# Altium project Laser_Module.PrjPCB (part 2 of 3)

## Sheet LVDS_ADC.SchDoc: ADC &
size 420 x 297 mm; CheckedBy: MK; Author: G.K.; CompanyName: CREOTECH; DrawnBy: G.K.; Organization: CTI SA; Address1: Creotech Instruments SA; Address2: Okulickiego 7/9, 05-500 Poland; DocumentNumber: 2; Revision: -; SheetNumber: 2; SheetTotal: 5; ModifiedBy: -; CreateDate: XX/XX/XXXX; CheckedDate: -; Title2: reference; DivGrp: CTI; Designer: G.K.; ModifiedDate: -; ProjectName: FMC DAC 100M 14B 16CHA ADC 2M 14B 4CHA
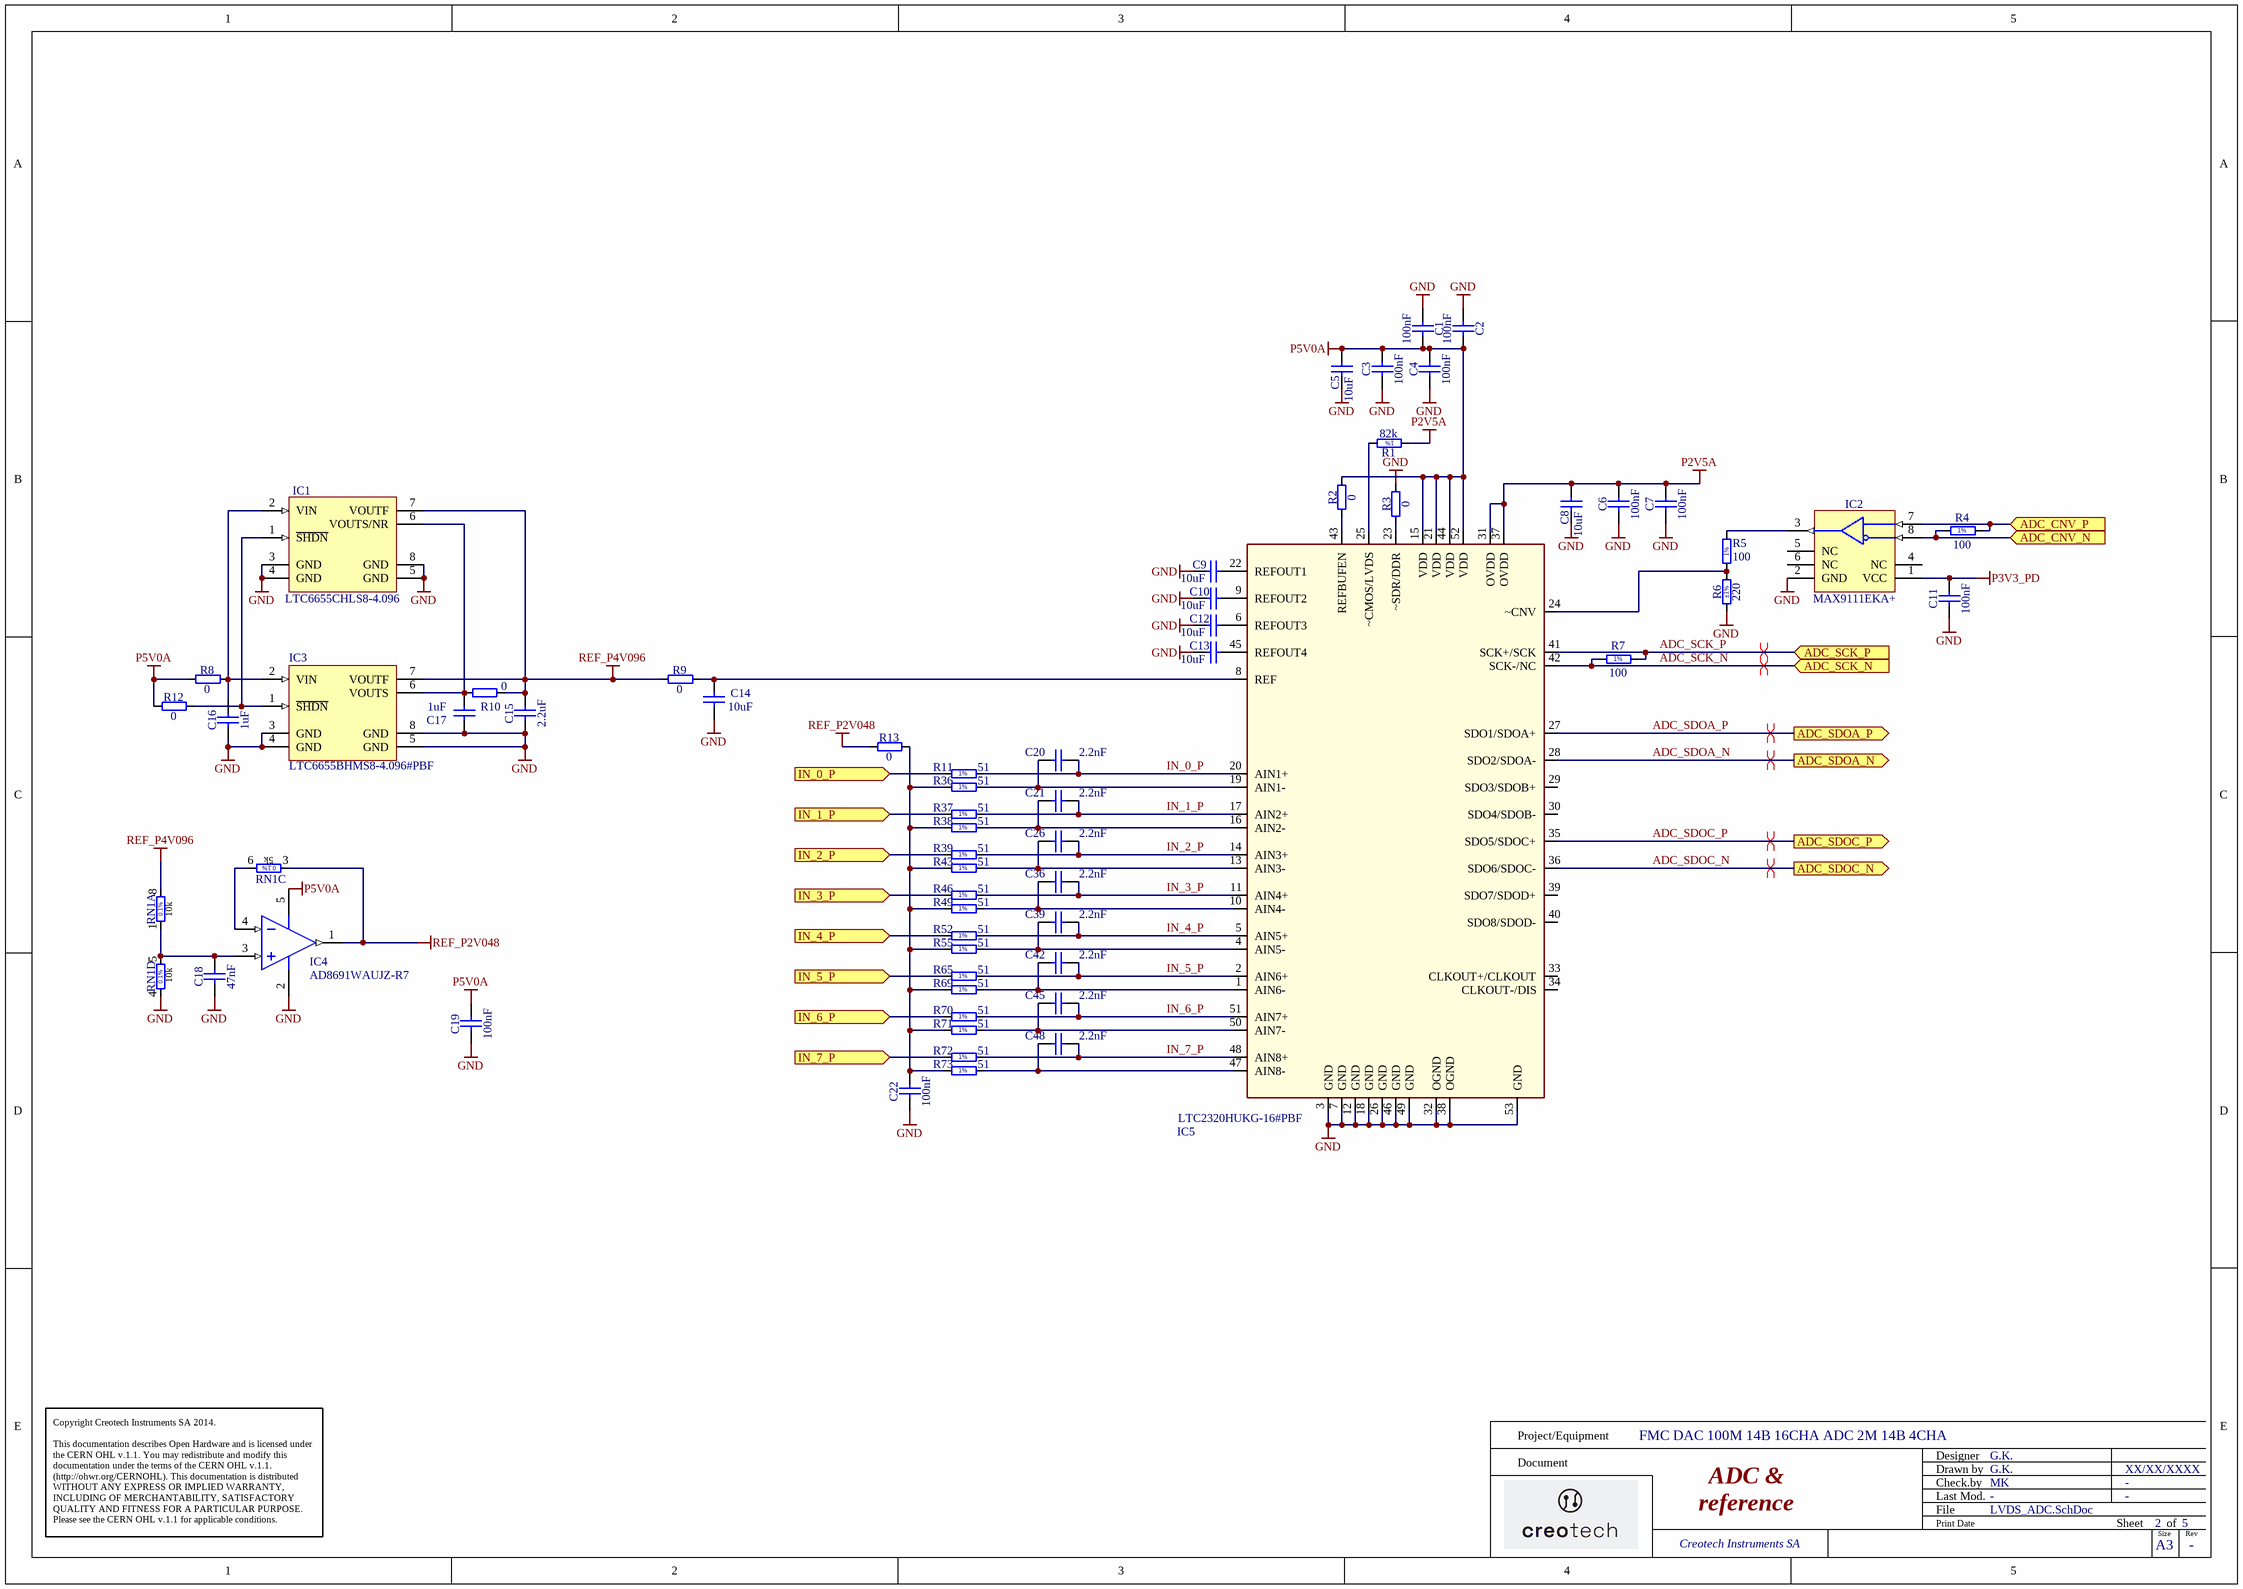
[diagram p2: LVDS_ADC.SchDoc]

### Parts
C1  100nF  [CAPC1608X87N]
C2  100nF  [CAPC1608X87N]
C3  100nF  [CAPC1608X87N]
C4  100nF  [CAPC1608X87N]
C5  10uF  [CAPC2012X95N]
C6  100nF  [CAPC1608X87N]
C7  100nF  [CAPC1608X87N]
C8  10uF  [CAPC2012X95N]
C9  10uF  [CAPC2012X95N]
C10  10uF  [CAPC2012X95N]
C11  100nF  [CAPC1608X87N]
C12  10uF  [CAPC2012X95N]
C13  10uF  [CAPC2012X95N]
C14  10uF  [CAPC2012X95N]
C15  2.2uF  [CAPC1608X87N]
C16  1uF  [CAPC1608X87N]
C17  1uF  [CAPC1608X87N]
C18  47nF  [CAPC2012X135N]
C19  100nF  [CAPC1005X55N]
C20  2.2nF  [CAPC2013X100N]
C21  2.2nF  [CAPC2013X100N]
C22  100nF  [CAPC1005X55N]
C26  2.2nF  [CAPC2013X100N]
C36  2.2nF  [CAPC2013X100N]
C39  2.2nF  [CAPC2013X100N]
C42  2.2nF  [CAPC2013X100N]
C45  2.2nF  [CAPC2013X100N]
C48  2.2nF  [CAPC2013X100N]
IC1  LTC6655CHLS8-4.096  [LCCS127P500X500X145-8N]
IC2  MAX9111EKA+  [SOT65P280X145-8N]
IC3  LTC6655BHMS8-4.096#PBF  [SOP65P490X110-8N]
IC4  AD8691WAUJZ-R7  [ADI-UJ-5_L]
IC5  LTC2320HUKG-16#PBF  [QFN50P700X800X80_HS-53M]
R1  82k  [RESC1608X55N]
R2  0  [RESC1005X40N]
R3  0  [RESC1005X40N]
R4  100  [RESC1005X40N]
R5  100  [RESC1005X40N]
R6  220  Tolerance: ±1%  [RESC1005X40N]
R7  100  [RESC1005X40N]
R8  0  [RESC1005X40N]
R9  0  [RESC1005X40N]
R10  0  [RESC1005X40N]
R11  51  [RESC1005X40N]
R12  0  [RESC1005X40N]
R13  0  [RESC1005X40N]
R36  51  [RESC1005X40N]
R37  51  [RESC1005X40N]
R38  51  [RESC1005X40N]
R39  51  [RESC1005X40N]
R43  51  [RESC1005X40N]
R46  51  [RESC1005X40N]
R49  51  [RESC1005X40N]
R52  51  [RESC1005X40N]
R55  51  [RESC1005X40N]
R65  51  [RESC1005X40N]
R69  51  [RESC1005X40N]
R70  51  [RESC1005X40N]
R71  51  [RESC1005X40N]
R72  51  [RESC1005X40N]
R73  51  [RESC1005X40N]
RN1  10k 5K 5K 10K  [SOIC127P600X175-8N]  (value not drawn)  (parts A,C,D of 4)

### Ports
ADC_CNV_N (in), ADC_CNV_P (in), ADC_SCK_N (in), ADC_SCK_P (in), ADC_SDOA_N (out), ADC_SDOA_P (out), ADC_SDOC_N (out), ADC_SDOC_P (out), IN_0_P (in), IN_1_P (in), IN_2_P (in), IN_3_P (in), IN_4_P (in), IN_5_P (in), IN_6_P (in), IN_7_P (in)

### Nets
GND: C1.1 C2.1 C3.1 C4.1 C5.1 C6.1 C7.1 C8.1 C9.1 C10.1 C11.1 C12.1 C13.1 C14.1 C15.1 C16.1 C17.1 C18.1 C19.1 C22.1 IC1.3(GND) IC1.4(GND) IC1.5(GND) IC1.8(GND) IC2.2(GND) IC3.3(GND) IC3.4(GND) IC3.5(GND) IC3.8(GND) IC4.2(-V) IC5.3(GND) IC5.7(GND) IC5.12(GND) IC5.18(GND) IC5.26(GND) IC5.32(OGND) IC5.38(OGND) IC5.46(GND) IC5.49(GND) IC5.53(GND) R3.2 R6.1 RN1.4
P2V5A: C6.2 C7.2 C8.2 IC5.31(OVDD) IC5.37(OVDD) R1.1
P3V3_PD: C11.2 IC2.1(VCC)
P5V0A: C1.2 C2.2 C3.2 C4.2 C5.2 C19.2 IC4.5(+V) IC5.15(VDD) IC5.21(VDD) IC5.44(VDD) IC5.52(VDD) R2.2 R8.1 R12.1
REF_P2V048: IC4.1(OUT) R13.1 RN1.3
REF_P4V096: C15.2 IC1.7(VOUTF) IC3.7(VOUTF) R9.1 R10.2 RN1.8
ADC_SCK_N: IC5.42(SCK-/NC) R7.1 ; port ADC_SCK_N
ADC_SCK_P: IC5.41(SCK+/SCK) R7.2 ; port ADC_SCK_P
ADC_SDOA_N: IC5.28(SDO2/SDOA-) ; port ADC_SDOA_N
ADC_SDOA_P: IC5.27(SDO1/SDOA+) ; port ADC_SDOA_P
ADC_SDOC_N: IC5.36(SDO6/SDOC-) ; port ADC_SDOC_N
ADC_SDOC_P: IC5.35(SDO5/SDOC+) ; port ADC_SDOC_P
IN_0_P: C20.1 IC5.20(AIN1+) R11.2
IN_1_P: C21.1 IC5.17(AIN2+) R37.2
IN_2_P: C26.1 IC5.14(AIN3+) R39.2
IN_3_P: C36.1 IC5.11(AIN4+) R46.2
IN_4_P: C39.1 IC5.5(AIN5+) R52.2
IN_5_P: C42.1 IC5.2(AIN6+) R65.2
IN_6_P: C45.1 IC5.51(AIN7+) R70.2
IN_7_P: C48.1 IC5.48(AIN8+) R72.2
QSPI_NCS_N: IC2.8(IN-) R4.1 ; port ADC_CNV_N
QSPI_NCS_P: IC2.7(IN+) R4.2 ; port ADC_CNV_P
NetC9_2: C9.2 IC5.22(REFOUT1)
NetC10_2: C10.2 IC5.9(REFOUT2)
NetC12_2: C12.2 IC5.6(REFOUT3)
NetC13_2: C13.2 IC5.45(REFOUT4)
NetC14_2: C14.2 IC5.8(REF) R9.2
NetC16_2: C16.2 IC1.2(VIN) IC3.2(VIN) R8.2
NetC17_2: C17.2 IC1.6(VOUTS/NR) IC3.6(VOUTS) R10.1
NetC18_2: C18.2 IC4.3(+IN) RN1.1 RN1.5
NetC20_2: C20.2 IC5.19(AIN1-) R36.2
NetC21_2: C21.2 IC5.16(AIN2-) R38.2
NetC22_2: C22.2 R13.2 R36.1 R38.1 R43.1 R49.1 R55.1 R69.1 R71.1 R73.1
NetC26_2: C26.2 IC5.13(AIN3-) R43.2
NetC36_2: C36.2 IC5.10(AIN4-) R49.2
NetC39_2: C39.2 IC5.4(AIN5-) R55.2
NetC42_2: C42.2 IC5.1(AIN6-) R69.2
NetC45_2: C45.2 IC5.50(AIN7-) R71.2
NetC48_2: C48.2 IC5.47(AIN8-) R73.2
NetC50_2: R70.1 ; port IN_6_P
NetC61_2: R11.1 ; port IN_0_P
NetC62_2: R37.1 ; port IN_1_P
NetC63_2: R39.1 ; port IN_2_P
NetC64_2: R46.1 ; port IN_3_P
NetC65_2: R52.1 ; port IN_4_P
NetC66_2: R65.1 ; port IN_5_P
NetIC1_1: IC1.1(~{SHDN}) IC3.1(~{SHDN}) R12.2
NetIC2_3: IC2.3(OUT) R5.2
NetIC4_4: IC4.4(-IN) RN1.6
NetIC5_23: IC5.23(~SDR/DDR) R3.1
NetIC5_24: IC5.24(~CNV) R5.1 R6.2
NetIC5_25: IC5.25(~CMOS/LVDS) R1.2
NetIC5_43: IC5.43(REFBUFEN) R2.1
NetR72_1: R72.1 ; port IN_7_P

Not connected (* = marked no-connect by the designer): IC2 4(NC) 5(NC) 6(NC); IC5 29(SDO3/SDOB+) 30(SDO4/SDOB-) 33(CLKOUT+/CLKOUT) 34(CLKOUT-/DIS) 39(SDO7/SDOD+) 40(SDO8/SDOD-)

### Layout directives
differential pair: ADC_SCK_N, ADC_SCK_P, ADC_SDOA_N, ADC_SDOA_P, ADC_SDOC_N, ADC_SDOC_P

### Notes on the sheet
- Project/Equipment
- Document
- Designer
- Drawn by
- Check.by
- Copyright Creotech Instruments SA 2014.
  This documentation describes Open Hardware and is licensed under the CERN OHL v.1.1. You may redistribute and modify this documentation under the terms of the CERN OHL v.1.1. (http://ohwr.org/CERNOHL). This documentation is distributed WITHOUT ANY EXPRESS OR IMPLIED WARRANTY, INCLUDING OF MERCHANTABILITY, SATISFACTORY QUALITY AND FITNESS FOR A PARTICULAR PURPOSE. Please see the CERN OHL v.1.1 for applicable conditions.
- File
- Last Mod.
- Print Date
- Sheet
- Size
- A3
- of
- Rev
- (in symbol R0402_51R_1%_0.0625W_100PPM) 1%
- (in symbol R0402_100R_1%_0.1W_100PPM) 1%
- (in symbol R0603_82K_1%_0.1W_100PPM) 1%
- (in symbol RN_10K_5K_VISHAY_AORN2-1AT3, part A) 10k
- (in symbol RN_10K_5K_VISHAY_AORN2-1AT3, part C) 5k
- (in symbol RN_10K_5K_VISHAY_AORN2-1AT3, part D) 10k

### Library data of the parts
C1-C4 C6 C7 C11 = CC0603_100NF_50V_10%_X7R: as C69 on sheet Laser_module; Part Number: CC0603_100NF_50V_10%_X7R; Component Kind: Standard; Component Type: Standard; Pin Count: 2; Value: 100nF; Status: Preferred; Manufacturer Part Number: CC0603_100NF_50V_10%_X7R; Case: 0603; Mounted: Yes; Socket: No; SMD: Yes; Sense: No; Manufacturer1 Example: PHYCOMP; Manufacturer1 ComponentHeight: 0.87mm; HelpURL: \\cern.ch\dfs\Applications\Altium\Datasheets\CC0603_X7R_PHYCOMP.pdf; Author: CERN DEM JLC; CreateDate: 03.12.2007; LatestRevisionDate: 03.12.2007
C5 C8-C10 C12-C14 = CC0805_10UF_25V_10%_X5R: Non-polarised capacitor; Part Description: SMD Multilayer Chip Ceramic Capacitor; Manufacturer: GENERIC; Manufacturer1 Part Number: GRM219R61E106KA12D; Voltage: 25V; TC: X5R; Tolerance: ±10%; Part Number: CC0805_10UF_25V_10%_X5R; Component Kind: Standard; Component Type: Standard; Pin Count: 2; Value: 10uF; Status: Preferred; Manufacturer Part Number: CC0805_10UF_25V_10%_X5R; Case: 0805; Mounted: Yes; Socket: No; SMD: Yes; Sense: No; Manufacturer1 Example: MURATA; Manufacturer1 ComponentHeight: 0.95mm; HelpURL: \\cern.ch\dfs\Applications\Altium\Datasheets\CC0805_X5R_MURATA_GRM.pdf; Author: CERN DEM JLC; CreateDate: 25.10.2012; LatestRevisionDate: 06.09.2016
C15 = CC0603_2.2UF_16V_10%_X5R: Non-polarised capacitor; Part Description: SMD Multilayer Chip Ceramic Capacitor; Manufacturer: GENERIC; Manufacturer1 Part Number: CC0603KRX5R7BB225; Voltage: 16V; TC: X5R; Tolerance: ±10%; Part Number: CC0603_2.2UF_16V_10%_X5R; Component Kind: Standard; Component Type: Standard; Pin Count: 2; Value: 2.2uF; Status: Preferred; Manufacturer Part Number: CC0603_2.2UF_16V_10%_X5R; Case: 0603; Mounted: Yes; Socket: No; SMD: Yes; Sense: No; Manufacturer1 Example: YAGEO; Manufacturer1 ComponentHeight: 0.9mm; HelpURL: \\cern.ch\dfs\Applications\Altium\Datasheets\CC0805_X5R_PHYCOMP_HC.pdf; Author: CERN DEM JLC; CreateDate: 28.04.2011; LatestRevisionDate: 28.04.2011
C16 C17 = CC0603_1UF_25V_10%_X7R: Non-polarised capacitor; Part Description: SMD Multilayer Chip Ceramic Capacitor; Manufacturer: GENERIC; Manufacturer1 Part Number: GRM188R71E105KA12D; Voltage: 25V; TC: X7R; Tolerance: ±10%; Part Number: CC0603_1UF_25V_10%_X7R; Component Kind: Standard; Component Type: Standard; Pin Count: 2; Value: 1uF; Status: None; Manufacturer Part Number: CC0603_1UF_25V_10%_X7R; Case: 0603; Mounted: Yes; Socket: No; SMD: Yes; Sense: No; Manufacturer1 Example: MURATA; Manufacturer1 ComponentHeight: 0.9mm; HelpURL: \\cern.ch\dfs\Applications\Altium\Datasheets\CC0603_X7R_MURATA.pdf; Author: CERN DEM JLC; CreateDate: 18.01.2011; LatestRevisionDate: 18.01.2011
C18 = CC0805_47NF_25V_5%_C0G: Non-polarised capacitor; Part Description: SMD Multilayer Chip Ceramic Capacitor; Manufacturer: GENERIC; Manufacturer1 Part Number: C0805C473J3GACTU; Voltage: 25V; TC: C0G/NP0; Tolerance: ±5%; Part Number: CC0805_47NF_25V_5%_C0G; Component Kind: Standard; Component Type: Standard; Pin Count: 2; Value: 47nF; Status: None; Manufacturer Part Number: CC0805_47NF_25V_5%_C0G; Case: 0805; Mounted: Yes; Socket: No; SMD: Yes; Sense: No; Manufacturer1 Example: KEMET; Manufacturer1 ComponentHeight: 1.4mm; HelpURL: \\cern.ch\dfs\Applications\Altium\Datasheets\CC0805_C0G_KEMET_(Commercial Grade).pdf; Author: CERN DEM JLC; CreateDate: 18.01.2011; LatestRevisionDate: 18.01.2011
C19 C22 = CC0402_100NF_16V_10%_X5R: Non-polarised capacitor; Part Description: SMD Multilayer Chip Ceramic Capacitor; Manufacturer: GENERIC; Manufacturer1 Part Number: GRM155R61C104KA88D; Voltage: 16V; TC: X5R; Tolerance: ±10%; Part Number: CC0402_100NF_16V_10%_X5R; Component Kind: Standard; Component Type: Standard; Pin Count: 2; Value: 100nF; Status: None; Manufacturer Part Number: CC0402_100NF_16V_10%_X5R; Case: 0402; Mounted: Yes; Socket: No; SMD: Yes; Sense: No; Manufacturer1 Example: MURATA; Manufacturer1 ComponentHeight: 0.55mm; HelpURL: \\cern.ch\dfs\Applications\Altium\Datasheets\CC0402_X5R_MURATA_GRM.pdf; Author: CERN DEM JLC; CreateDate: 10.12.2013; LatestRevisionDate: 10.12.2013
C20 C21 C26 C36 C39 C42 C45 C48 = CC0805_2.2NF_25V_1%_C0G: Non-polarised capacitor; Part Description: SMD Multilayer Chip Ceramic Capacitor; Manufacturer: GENERIC; Manufacturer1 Part Number: C0805C222F3GACTU; Voltage: 25V; TC: C0G/NP0; Tolerance: ±1%; Part Number: CC0805_2.2NF_25V_1%_C0G; Component Kind: Standard; Component Type: Standard; Pin Count: 2; Value: 2.2nF; Status: None; Manufacturer Part Number: CC0805_2.2NF_25V_1%_C0G; Case: 0805; Mounted: Yes; Socket: No; SMD: Yes; Sense: No; Manufacturer1 Example: KEMET; Manufacturer1 ComponentHeight: 0.88mm; HelpURL: \\cern.ch\dfs\Applications\Altium\Datasheets\CC0805_C0G_KEMET_(Commercial Grade).pdf; Author: CERN DEM JLC; CreateDate: 11.03.2015; LatestRevisionDate: 11.03.2015
IC1 = REF_LTC6655CHLS8-4.096: 4.096, 1uA Precision Voltage Reference; Part Number: LTC6655CHLS8-4.096#PBF; Part Description: 4.096V, 0.05%, 10ppm/°C, 1uA Precision Voltage Reference; Manufacturer: LINEAR TECHNOLOGY; PressFit: No; Bonding: No; Component Kind: Standard; Component Type: Standard; Device: LTC6655CHLS8-4.096; Footprint: SOT95P280X100-6N; PackageDescription: LCC, 8-Pins, Body 5,00x5,00mmx1,45mm, Pitch 1,27mm, IPC Medium Density; Manufacturer Part Number: LTC6655CHLS8-4.096#PBF; Pin Count: 8; Case: 8-CLCC; Mounted: Yes; Socket: No; SMD: Yes; Sense: No; ComponentHeight: 1mm; HelpURL: \\cern.ch\dfs\Applications\Altium\Datasheets\LT6656ACS6-3.3#TRMPBF.pdf; Author: GK; CreateDate: 2011-10-10; LatestRevisionDate: 2011-10-10
IC2 = MAX9111EKA+: Single LVDS Line Receiver with Ultra-Low Pulse Skew; Manufacturer: MAXIM; PressFit: No; Bonding: No; Part Number: MAX9111EKA+; Component Kind: Standard; Component Type: Standard; Device: MAX9111EKA+; PackageDescription: SOT, 0.65mm pitch; 8 pin, 1.625mm W X 2.90mm L X 1.45mm H body, IPC Medium Density; Part Description: Single LVDS Line Receiver with Ultra-Low Pulse Skew; Manufacturer Part Number: MAX9111EKA+; Pin Count: 8; Case: SOT23-8; Mounted: Yes; Socket: No; SMD: Yes; Sense: No; ComponentHeight: 1.45mm; Author: CERN DEM JLC; HelpURL: \\cern.ch\dfs\Applications\Altium\Datasheets\MAX9111EKA+.pdf; CreateDate: 26.09.2013; LatestRevisionDate: 26.09.2013
IC3 = REF_LTC6655: 0.25ppm Noise, Low Drift Precision Buffered Voltage Reference; Part Description: 4.096V, 0.25ppm Noise, Low Drift Precision Buffered Voltage Reference; Manufacturer: LINEAR TECHNOLOGY; PressFit: No; Bonding: No; Part Number: LTC6655BHMS8-4.096#PBF; Component Kind: Standard; Component Type: Standard; Device: LTC6655BHMS8-4.096#PBF; PackageDescription: SOP, 8-Leads, Body 3.1x3.1mm (max), Pitch 0.65mm, IPC Medium Density; Manufacturer Part Number: LTC6655BHMS8-4.096#PBF; Pin Count: 8; Case: SSOP8; Mounted: Yes; Socket: No; SMD: Yes; Sense: No; ComponentHeight: 1.1mm; HelpURL: \\cern.ch\dfs\Applications\Altium\Datasheets\LTC6655BHMS8-5#PBF.pdf; Author: GK; CreateDate: 07.06.2012; LatestRevisionDate: 07.06.2012
IC4 = CMP-0384-02080-1: Single Channel Wide Bandwidth Operational Amplifier, 10 MHz BW, 5 V/us SR, Automotive, 5-pin SOT23 (UJ-5), Reel; Manufacturer: Analog Devices; Generic Part Number: AD8691; Small Signal Bandwidth: 10MHz; Input Offset Voltage: 400uV; V Span Max: 6V; Automotive Qualified: Yes; Slew Rate: 5V/us; Iq/Amp: 1.05mA; Amplifiers Per Package: 1; Input Bias Current: 200fA; V Span Min: 2.7V; ComponentLink2URL: http://www.analog.com/static/imported-files/data_sheets/AD8691_8692_8694.pdf; ComponentLink3Description: Package Specification; ComponentLink1Description: Manufacturer URL; ComponentLink1URL: http://www.analog.com/en/index.html; PackageReference: UJ-5; DatasheetVersion: Rev. E; PartNumber: AD8691WAUJZ-R7; PackageVersion: 100708-A; PackageDescription: 5-Pin Thin Small Outline Transistor Package, Body 2.9 x 1.6 mm, Pitch 0.95 mm; Code_JEDEC: MO-193-AB; Mounting Technology: Surface Mount; ComponentLink3URL: http:/www.analog.com/static/imported-files/packages/PKG_PDF/TSOT(UJ)/UJ_5.pdf; ComponentLink2Description: Datasheet
IC5 = ADC_LTC2320HUKG-16: Octal, 16-Bit, 1.5Msps/Ch  Simultaneous Sampling ADC; Manufacturer: LINEAR TECHNOLOGY; PressFit: No; Bonding: No; Part Number: LTC2320HUKG-16#PBF; Component Kind: Standard; Component Type: Standard; Device: LTC2320HUKG-16#PBF; PackageDescription: QFN, 52-Leads, Body 7.00x8.00mm, Pitch 0.50mm, Thermal Pad 5.41x6.40mm, IPC Low Density; Part Description: Octal, 16-Bit, 1.5Msps/Ch  Simultaneous Sampling ADC; Manufacturer Part Number: LTC2320HUKG-16#PBF; Pin Count: 48; Case: QFP48; Mounted: Yes; Socket: No; SMD: Yes; Sense: No; ComponentHeight: 0.8; Author: GK; HelpURL: \\cern.ch\dfs\Applications\Altium\Datasheets\LTC2335CLX-18#PBF.pdf; CreateDate: 10.01.2017; LatestRevisionDate: 10.01.2017
R1 = R0603_82K_1%_0.1W_100PPM: Resistor - 1%; Part Description: General Purpose Thick Film Chip Resistor; Manufacturer: GENERIC; Manufacturer1 Part Number: NRC06F8202TRF; Power: 0.1W; TC: ±100ppm/°C; Part Number: R0603_82K_1%_0.1W_100PPM; Component Kind: Standard; Component Type: Standard; Pin Count: 2; Value: 82k; Status: Preferred; Tolerance: ±1%; Manufacturer Part Number: R0603_82K_1%_0.1W_100PPM; Case: 0603; Mounted: Yes; Sense: No; Socket: No; SMD: Yes; Manufacturer1 Example: NIC COMPONENT; Manufacturer1 ComponentHeight: 0.55mm; HelpURL: \\cern.ch\dfs\Applications\Altium\Datasheets\R0603_NIC_NRC.pdf; Author: CERN DEM JLC; CreateDate: 03.12.2007; LatestRevisionDate: 13.03.2008
R2 R3 R8-R10 R12 R13 = R0402_0R_JUMPER: Resistor; Part Description: 1A (0.05R Max DC Resistance) Zero Ohm Jumper; Manufacturer: GENERIC; Manufacturer1 Part Number: 232270591001L; Part Number: R0402_0R_JUMPER; Component Kind: Standard; Component Type: Standard; Pin Count: 2; Value: 0; Status: Not recommended; Manufacturer Part Number: R0402_0R_JUMPER; Case: 0402; Mounted: Yes; Sense: No; Socket: No; SMD: Yes; Manufacturer1 Example: YAGEO PHYCOMP; Manufacturer1 ComponentHeight: 0.4mm; HelpURL: \\cern.ch\dfs\Applications\Altium\Datasheets\R0402_Phycomp_RC0402.pdf; Author: CERN DEM JLC; CreateDate: 03.12.2007; LatestRevisionDate: 17.10.2012
R4 R5 R7 = R0402_100R_1%_0.1W_100PPM: Resistor - 1%; Part Description: General Purpose Thick Film Chip Resistor; Manufacturer: GENERIC; Manufacturer Part Number: R0402_100R_1%_0.1W_100PPM_50V; Manufacturer1 Part Number: ERJ2RKF1000X; Power: 0.1W; TC: ±100ppm/°C; Voltage: 50V; Part Number: R0402_100R_1%_0.1W_100PPM; Component Kind: Standard; Component Type: Standard; Pin Count: 2; Value: 100; Status: Not recommended; Tolerance: ±1%; Case: 0402; Mounted: Yes; Sense: No; Socket: No; SMD: Yes; Manufacturer1 Example: PANASONIC; Manufacturer1 ComponentHeight: 0.4mm; HelpURL: \\cern.ch\dfs\Applications\Altium\Datasheets\R0402_PANASONIC_ERJ2RK.pdf; Author: CERN DEM JLC; CreateDate: 12.12.2013; LatestRevisionDate: 03.03.2015
R6 = R0402_220R_1%_0.0625W_100PPM: Resistor - 1%; Part Description: General Purpose Thick Film Chip Resistor; Manufacturer: GENERIC; Manufacturer1 Part Number: 232270672201L; TC: ±100ppm/°C; PressFit: No; Part Number: R0402_220R_1%_0.0625W_100PPM; Component Kind: Standard; Component Type: Standard; Pin Count: 2; Value: 220; Status: Not Recommended; Power: 0.0625W; Manufacturer Part Number: R0402_220R_1%_0.0625W_100PPM; Case: 0402; Mounted: Yes; Sense: No; Socket: No; SMD: Yes; Manufacturer1 Example: YAGEO PHYCOMP; Manufacturer1 ComponentHeight: 0.4mm; HelpURL: \\cern.ch\dfs\Applications\Altium\Datasheets\R0402_Phycomp_RC0402.pdf; Author: CERN DEM JLC; CreateDate: 03.12.2007; LatestRevisionDate: 17.10.2012
R11 R36-R39 R43 R46 R49 R52 R55 R65 R69-R73 = R0402_51R_1%_0.0625W_100PPM: Resistor - 1%; Part Description: General Purpose Thick Film Chip Resistor; Manufacturer: GENERIC; Manufacturer1 Part Number: 232270675109L; TC: ±100ppm/°C; PressFit: No; Part Number: R0402_51R_1%_0.0625W_100PPM; Component Kind: Standard; Component Type: Standard; Pin Count: 2; Value: 51; Status: Not Recommended; Power: 0.0625W; Tolerance: ±1%; Manufacturer Part Number: R0402_51R_1%_0.0625W_100PPM; Case: 0402; Mounted: Yes; Sense: No; Socket: No; SMD: Yes; Manufacturer1 Example: YAGEO PHYCOMP; Manufacturer1 ComponentHeight: 0.4mm; HelpURL: \\cern.ch\dfs\Applications\Altium\Datasheets\R0402_Phycomp_RC0402.pdf; Author: CERN DEM JLC; CreateDate: 03.12.2007; LatestRevisionDate: 17.10.2012
RN1 = RN_10K_5K_VISHAY_AORN2-1AT3: DIL8 Resistor Network 4 Resistors 10k-5k-5k-10k 0.1%; Part Description: Dual-In-Line Thin Film Precision Automotive Resistors Network, (4 Isolated) - AORN Series; Manufacturer: VISHAY DALE; Power: 4x0.1W; TC: ±25ppm/°C; PressFit: No; Part Number: RN_10K_5K_VISHAY_AORN2-1AT3; Component Kind: Standard; Component Type: Standard; Pin Count: 8; Value: 10k 5K 5K 10K; Sense: No; Tolerance: 0.1%; Manufacturer Part Number: AORN2-1AT3; Case: SOIC8; Mounted: Yes; Socket: No; SMD: Yes; ComponentHeight: 1.73mm; HelpURL: \\cern.ch\dfs\Applications\Altium\Datasheets\RN_VISHAY_AORN.pdf; Author: CERN DEM JLC; CreateDate: 20.02.2017; LatestRevisionDate: 20.02.2017

## Sheet Sensors_AFE2.schdoc: Temp Sensor
size 420 x 297 mm; EDA_Number: ARTIQ; Projet: KASLI 3U subsystem; CheckedBy: MK; Author: G.K.; CompanyName: CREOTECH; DrawnBy: G.K.; Organization: CTI SA; Address1: Creotech Instruments SA; Address2: Okulickiego 7/9, 05-500 Poland; DocumentNumber: 4; Revision: -; SheetNumber: 4; SheetTotal: 5; ModifiedBy: -; CreateDate: XX/XX/XXXX; CheckedDate: -; Title2: AFE; DivGrp: CTI; Designer: G.K.; ModifiedDate: -; ProjectName: FMC DAC 100M 14B 16CHA ADC 2M 14B 4CHA
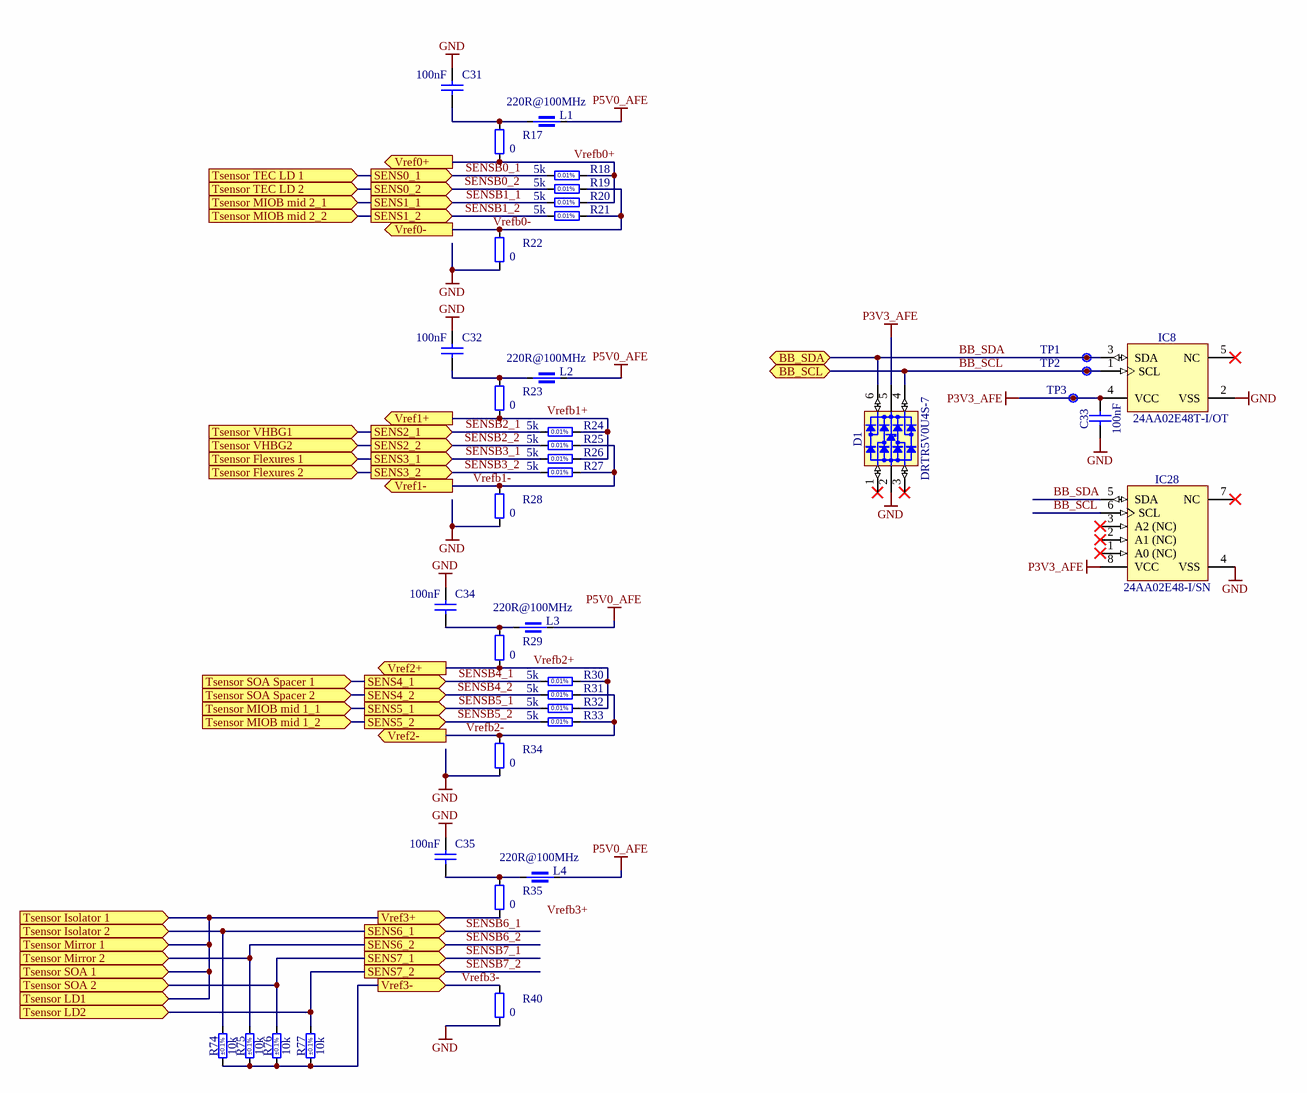
[diagram p3: Sensors_AFE2.schdoc]

### Parts
C31  100nF  [CAPC1005X55N]
C32  100nF  [CAPC1005X55N]
C33  100nF  [CAPC1005X55N]
C34  100nF  [CAPC1005X55N]
C35  100nF  [CAPC1005X55N]
D1  DRTR5V0U4S-7  [SOT65P210X110-6N]
IC8  24AA02E48T-I/OT  [SOT95P280X145-5N]
IC28  24AA02E48-I/SN  [SOIC127P600X175-8N]
L1  220R@100MHz  [INDC1005X55N]
L2  220R@100MHz  [INDC1005X55N]
L3  220R@100MHz  [INDC1005X55N]
L4  220R@100MHz  [INDC1005X55N]
R17  0  [RESC1608X55N]
R18  5k  [RESC2013X64N]
R19  5k  [RESC2013X64N]
R20  5k  [RESC2013X64N]
R21  5k  [RESC2013X64N]
R22  0  [RESC1608X55N]
R23  0  [RESC1608X55N]
R24  5k  [RESC2013X64N]
R25  5k  [RESC2013X64N]
R26  5k  [RESC2013X64N]
R27  5k  [RESC2013X64N]
R28  0  [RESC1608X55N]
R29  0  [RESC1608X55N]
R30  5k  [RESC2013X64N]
R31  5k  [RESC2013X64N]
R32  5k  [RESC2013X64N]
R33  5k  [RESC2013X64N]
R34  0  [RESC1608X55N]
R35  0  [RESC1608X55N]
R40  0  [RESC1608X55N]
R74  10k  Tolerance: ±0.1%  [RESC1608X55N]
R75  10k  Tolerance: ±0.1%  [RESC1608X55N]
R76  10k  Tolerance: ±0.1%  [RESC1608X55N]
R77  10k  Tolerance: ±0.1%  [RESC1608X55N]
TP1  Test Point  [TPS127]  (value not drawn)
TP2  Test Point  [TPS127]  (value not drawn)
TP3  Test Point  [TPS127]  (value not drawn)

### Ports
BB_SCL (bidir), BB_SDA (bidir), SENS0_1 (out), SENS0_2 (out), SENS1_1 (out), SENS1_2 (out), SENS2_1 (out), SENS2_2 (out), SENS3_1 (out), SENS3_2 (out), SENS4_1 (out), SENS4_2 (out), SENS5_1 (out), SENS5_2 (out), SENS6_1 (out), SENS6_2 (out), SENS7_1 (out), SENS7_2 (out), Tsensor Flexures 1 (in), Tsensor Flexures 2 (in), Tsensor Isolator 1 (in), Tsensor Isolator 2 (in), Tsensor LD1 (in), Tsensor LD2 (in), Tsensor MIOB mid 1_1 (in), Tsensor MIOB mid 1_2 (in), Tsensor MIOB mid 2_1 (in), Tsensor MIOB mid 2_2 (in), Tsensor Mirror 1 (in), Tsensor Mirror 2 (in), Tsensor SOA 1 (in), Tsensor SOA 2 (in), Tsensor SOA Spacer 1 (in), Tsensor SOA Spacer 2 (in), Tsensor TEC LD 1 (in), Tsensor TEC LD 2 (in), Tsensor VHBG1 (in), Tsensor VHBG2 (in), Vref0+ (out), Vref0- (out), Vref1+ (out), Vref1- (out), Vref2+ (out), Vref2- (out), Vref3+ (out), Vref3- (out)

### Nets
GND: C31.1 C32.1 C33.1 C34.1 C35.1 D1.2(GND) IC8.2(VSS) IC28.4(VSS) R22.1 R28.1 R34.1 R40.1
P3V3_AFE: C33.2 D1.5(VBUS) IC8.4(VCC) IC28.8(VCC) TP3.1
P5V0_AFE: L1.2 L2.2 L3.2 L4.2
BB_SCL: D1.4(I/O3) IC8.1(SCL) IC28.6(SCL) TP2.1 ; port BB_SCL  [project net AFE2_SDA]
BB_SDA: D1.6(I/O4) IC8.3(SDA) IC28.5(SDA) TP1.1 ; port BB_SDA  [project net AFE2_SCL]
SENSB0_1: R18.1 ; port SENS0_1, port Tsensor TEC LD 1  [project net SENS_TH2_0_1]
SENSB0_2: R19.1 ; port SENS0_2, port Tsensor TEC LD 2  [project net SENS_TH2_0_2]
SENSB1_1: R20.1 ; port SENS1_1, port Tsensor MIOB mid 2_1  [project net SENS_TH2_1_1]
SENSB1_2: R21.1 ; port SENS1_2, port Tsensor MIOB mid 2_2  [project net SENS_TH2_1_2]
SENSB2_1: R24.1 ; port SENS2_1, port Tsensor VHBG1  [project net SENS_TH2_2_1]
SENSB2_2: R25.1 ; port SENS2_2, port Tsensor VHBG2  [project net SENS_TH2_2_2]
SENSB3_1: R26.1 ; port SENS3_1, port Tsensor Flexures 1  [project net SENS_TH2_3_1]
SENSB3_2: R27.1 ; port SENS3_2, port Tsensor Flexures 2  [project net SENS_TH2_3_2]
SENSB4_1: R30.1 ; port SENS4_1, port Tsensor SOA Spacer 1  [project net SENS_TH2_4_1]
SENSB4_2: R31.1 ; port SENS4_2, port Tsensor SOA Spacer 2  [project net SENS_TH2_4_2]
SENSB5_1: R32.1 ; port SENS5_1, port Tsensor MIOB mid 1_1  [project net SENS_TH2_5_1]
SENSB5_2: R33.1 ; port SENS5_2, port Tsensor MIOB mid 1_2  [project net SENS_TH2_5_2]
SENSB6_1: R74.2 ; port SENS6_1, port Tsensor Isolator 2  [project net SENS_TH2_6_1]
SENSB6_2: R75.2 ; port SENS6_2, port Tsensor Mirror 2  [project net SENS_TH2_6_2]
SENSB7_1: R76.2 ; port SENS7_1, port Tsensor SOA 2  [project net SENS_TH2_7_1]
SENSB7_2: R77.2 ; port SENS7_2, port Tsensor LD2  [project net SENS_TH2_7_2]
TH2_Vref3+: R35.1 ; port Vref3+, port Tsensor Isolator 1, port Tsensor Mirror 1, port Tsensor LD1, port Tsensor SOA 1
Vrefb0+: R17.1 R18.2 R20.2 ; port Vref0+  [project net TH2_Vref0+]
Vrefb0-: R19.2 R21.2 R22.2 ; port Vref0-  [project net TH2_Vref0-]
Vrefb1+: R23.1 R24.2 R26.2 ; port Vref1+  [project net TH2_Vref1+]
Vrefb1-: R25.2 R27.2 R28.2 ; port Vref1-  [project net TH2_Vref1-]
Vrefb2+: R29.1 R30.2 R32.2 ; port Vref2+  [project net TH2_Vref2+]
Vrefb2-: R31.2 R33.2 R34.2 ; port Vref2-  [project net TH2_Vref2-]
Vrefb3-: R40.2 R74.1 R75.1 R76.1 R77.1 ; port Vref3-  [project net TH2_Vref3-]
NetC31_2: C31.2 L1.1 R17.2
NetC32_2: C32.2 L2.1 R23.2
NetC34_2: C34.2 L3.1 R29.2
NetC35_2: C35.2 L4.1 R35.2

Not connected (* = marked no-connect by the designer): D1 1(I/O1)* 3(I/O2)*; IC8 5(NC)*; IC28 1(A0_(NC))* 2(A1_(NC))* 3(A2_(NC))* 7(NC)*

### Notes on the sheet
- Labels drawn without touching a wire or pin: Vrefb3+
- Project/Equipment
- Document
- Designer
- Drawn by
- Check.by
- Copyright Creotech Instruments SA 2014.
  This documentation describes Open Hardware and is licensed under the CERN OHL v.1.1. You may redistribute and modify this documentation under the terms of the CERN OHL v.1.1. (http://ohwr.org/CERNOHL). This documentation is distributed WITHOUT ANY EXPRESS OR IMPLIED WARRANTY, INCLUDING OF MERCHANTABILITY, SATISFACTORY QUALITY AND FITNESS FOR A PARTICULAR PURPOSE. Please see the CERN OHL v.1.1 for applicable conditions.
- File
- Last Mod.
- Print Date
- Sheet
- Size
- A3
- of
- Rev
- (in symbol R0805_5K_0.01%_0.2W_0.2PPM_VISHAY_VSMP) 0.01%

### Library data of the parts
C31-C35 = CC0402_100NF_16V_10%_X5R: as C19 on sheet LVDS_ADC; Part Number: CC0402_100NF_16V_10%_X5R; Component Kind: Standard; Component Type: Standard; Pin Count: 2; Value: 100nF; Status: None; Manufacturer Part Number: CC0402_100NF_16V_10%_X5R; Case: 0402; Mounted: Yes; Socket: No; SMD: Yes; Sense: No; Manufacturer1 Example: MURATA; Manufacturer1 ComponentHeight: 0.55mm; HelpURL: \\cern.ch\dfs\Applications\Altium\Datasheets\CC0402_X5R_MURATA_GRM.pdf; Author: CERN DEM JLC; CreateDate: 10.12.2013; LatestRevisionDate: 10.12.2013
D1 = D_TVS_DRTR5V0U4S-7: Integrated Quad Ultra-Low Capacitance ESD Protection; Part Description: Integrated Quad Ultra-Low Capacitance ESD (±8kV) Protection; Manufacturer: DIODES; PressFit: No; Bonding: No; Status Comment: Active; Part Number: DRTR5V0U4S-7; Component Kind: Standard; Component Type: Standard; Device: DRTR5V0U4S-7; PackageDescription: SOT363, SC70-6, 0.65mm Pitch; 6 Pin, 1.25mm W X 2.00mm L X 1.10mm H body, IPC Medium Density; Status: Active; Manufacturer Part Number: DRTR5V0U4S-7; Pin Count: 6; Case: SOT363; Mounted: Yes; Socket: No; SMD: Yes; Sense: No; ComponentHeight: 1.1mm; HelpURL: \\cern.ch\dfs\Applications\Altium\Datasheets\PRTR5V0U4Y.pdf; Author: GK; CreateDate: 24.01.2017; LatestRevisionDate: 14.09.2020
IC8 = 24AA02E48T-I/OT: 1.7V-5.5V, 2K I2C Serial EEPROM With EUI-48 Node Identity; Manufacturer: MICROCHIP TECHNOLOGY; PressFit: No; Bonding: No; Part Number: 24AA02E48T-I/OT; Component Kind: Standard; Component Type: Standard; Device: 24AA02E48T-I/OT; PackageDescription: SOT, 0.95mm pitch; 5 pin, 1.60mm W X 2.90mm L X 1.45mm H body, IPC Medium Density; Part Description: 1.7V-5.5V, 2K I2C Serial EEPROM With EUI-48 Node Identity; Manufacturer Part Number: 24AA02E48T-I/OT; Pin Count: 5; Case: SOT23-5; Mounted: Yes; Socket: No; SMD: Yes; Sense: No; ComponentHeight: 1.45mm; HelpURL: \\cern.ch\dfs\Applications\Altium\Datasheets\24AA02E48T-I-OT.pdf; Author: CERN DEM MR; CreateDate: 31.03.2016; LatestRevisionDate: 31.03.2016
IC28 = MEM_24AA02E48-I/SN: 1.7V-5.5V, 2K I2C™ Serial EEPROMs with EUI-48™ Node Identity; Manufacturer: MICROCHIP TECHNOLOGY; PressFit: No; Bonding: No; Part Number: 24AA02E48-I/SN; Component Kind: Standard; Component Type: Standard; Device: 24AA02E48-I/SN; PackageDescription: SOIC, 1.27mm Pitch; 8 Pin - Body 4x5mm, IPC Medium Density; Part Description: 1.7V-5.5V, 2K I2C™ Serial EEPROMs with EUI-48™ Node Identity; Manufacturer Part Number: 24AA02E48-I/SN; Pin Count: 8; Case: SOIC8; Mounted: Yes; Socket: No; SMD: Yes; Sense: No; ComponentHeight: 1.75mm; HelpURL: \\cern.ch\dfs\Applications\Altium\Datasheets\24AA025E48-I-SN.pdf; Author: CERN DEM MR; CreateDate: 19.07.2016; LatestRevisionDate: 19.07.2016
L1-L4 = IND0402_MURATA_BLM15HB221SN1: Part Description: SMD EMIFIL Suppression Chip Ferrite Bead; Manufacturer: MURATA; Power: 250mA; Resistance: 1R; Tolerance: ±25%; Part Number: IND0402_MURATA_BLM15HB221SN1; Component Kind: Standard; Component Type: Standard; Pin Count: 2; Value: 220R@100MHz; Status: None; Manufacturer Part Number: BLM15HB221SN1; Case: 0402; Mounted: Yes; Socket: No; SMD: Yes; Sense: No; ComponentHeight: 0.55mm; HelpURL: \\cern.ch\dfs\Applications\Altium\Datasheets\IND0402_MURATA_BLM15H.pdf; Author: CERN DEM JLC; CreateDate: 23.06.2009; LatestRevisionDate: 25.10.2018
R17 R22 R23 R28 R29 R34 R35 R40 = R0603_0R_JUMPER: Resistor; Part Description: 1A (0.05R Max DC Resistance) Zero Ohm Jumper; Manufacturer: GENERIC; Manufacturer1 Part Number: NRC06Z0; PressFit: No; Part Number: R0603_0R_JUMPER; Component Kind: Standard; Component Type: Standard; Pin Count: 2; Value: 0; Status: Preferred; Manufacturer Part Number: R0603_0R_JUMPER; Case: 0603; Mounted: Yes; Sense: No; Socket: No; SMD: Yes; Manufacturer1 Example: NIC COMPONENT; Manufacturer1 ComponentHeight: 0.55mm; HelpURL: \\cern.ch\dfs\Applications\Altium\Datasheets\R0603_NIC_NRC.pdf; Author: CERN DEM JLC; CreateDate: 03.12.2007; LatestRevisionDate: 13.03.2008
R18-R21 R24-R27 R30-R33 = R0805_5K_0.01%_0.2W_0.2PPM_VISHAY_VSMP: Resistor - 0.01%; Part Description: Ultra High Precision Foil Wraparound Surface Mount Chip Resistor; Manufacturer: VISHAY PRECISION; Manufacturer Part Number: Y16245K00000T9R; Power: 0.2W; TC: ±0.2ppm/°C; PressFit: No; Part Number: R0805_5K_0.01%_0.2W_0.2PPM_VISHAY_VSMP; Component Kind: Standard; Component Type: Standard; Pin Count: 2; Value: 5k; Status: None; Tolerance: ±0.01%; Case: 0805; Mounted: Yes; Sense: No; Socket: No; SMD: Yes; Manufacturer1 ComponentHeight: 0.64mm; HelpURL: \\cern.ch\dfs\Applications\Altium\Datasheets\R0805_VISHAY_VSMP.pdf; Author: CERN DEM JLC; CreateDate: 22.09.2011; LatestRevisionDate: 22.09.2011
R74-R77 = R0603_10K_0.1%_0.063W_10PPM: Resistor - 0.1%; Part Description: Thin Film Chip Resistor; Manufacturer: GENERIC; Manufacturer1 Part Number: RN73C1J10KBTDF; Power: 0.063W; TC: ±10ppm; PressFit: No; Part Number: R0603_10K_0.1%_0.063W_10PPM; Component Kind: Standard; Component Type: Standard; Pin Count: 2; Value: 10k; Status: Not Recommended; Manufacturer Part Number: R0603_10K_0.1%_0.063W_10PPM; Case: 0603; Mounted: Yes; Sense: No; Socket: No; SMD: Yes; Manufacturer1 Example: TYCO HOLSWORTHY; Manufacturer1 ComponentHeight: 0.5mm; HelpURL: \\cern.ch\dfs\Applications\Altium\Datasheets\R0603_Tyco_RN73.pdf; Author: CERN DEM JLC; CreateDate: 03.12.2007; LatestRevisionDate: 13.03.2008
TP1-TP3 = SMD_PAD_1.27X1.27MM: Part Description: 1.27mm x 1.27mm PCB Copper Area (SMD Test Point); Mounted: No; Part Number: SMD_PAD_1.27X1.27MM; Component Kind: Standard (No BOM); Component Type: Standard (No BOM); Pin Count: 1; Family: Test Point; Socket: No; SMD: Yes; Sense: No; Status: None; ComponentHeight: 0mm; HelpURL: Undefined; Author: CERN DEM JLC; CreateDate: 12.01.2008; LatestRevisionDate: 12.01.2008; PackageDescription: 1.27mm x 1.27mm PCB Copper Area (SMD Test Point)

## Sheet Laser_module_supply.schdoc: Laser Module
size 420 x 297 mm; CheckedBy: MK; Author: G.K.; CompanyName: CREOTECH; DrawnBy: G.K.; Organization: CTI SA; Address1: Creotech Instruments SA; Address2: Okulickiego 7/9, 05-500 Poland; DocumentNumber: 5; Revision: -; SheetNumber: 5; SheetTotal: 5; ModifiedBy: -; CreateDate: XX/XX/XXXX; CheckedDate: -; Title2: Supply; DivGrp: CTI; Designer: G.K.; ModifiedDate: -; ProjectName: FMC DAC 100M 14B 16CHA ADC 2M 14B 4CHA
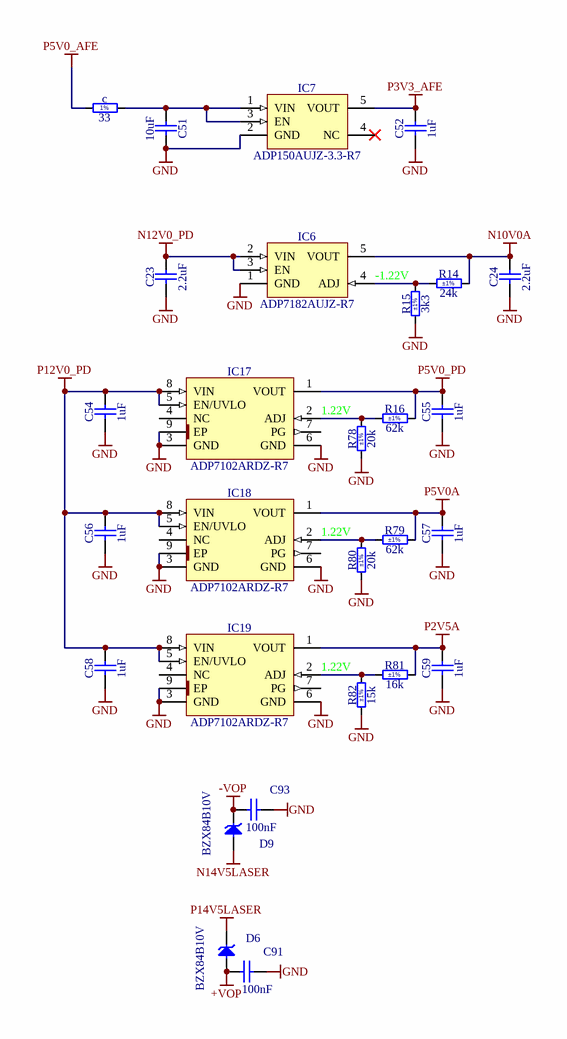
[diagram p4: Laser_module_supply.schdoc]

### Parts
c  33  [RESC1005X40N]
C23  2.2uF  [CAPC2012X135N]
C24  2.2uF  [CAPC2012X135N]
C51  10uF  [CAPC2012X135N]
C52  1uF  [CAPC1608X87N]
C54  1uF  [CAPC1608X87N]
C55  1uF  [CAPC1608X87N]
C56  1uF  [CAPC1608X87N]
C57  1uF  [CAPC1608X87N]
C58  1uF  [CAPC1608X87N]
C59  1uF  [CAPC1608X87N]
C91  100nF  [CAPC1608X87N]
C93  100nF  [CAPC1608X87N]
D6  BZX84B10V  [SOT95P248X115-3N]
D9  BZX84B10V  [SOT95P248X115-3N]
IC6  ADP7182AUJZ-R7  [SOT95P280X90-5N]
IC7  ADP150AUJZ-3.3-R7  [SOT95P280X90-5N]
IC17  ADP7102ARDZ-R7  [SOIC127P600X175-9N-R241X309]
IC18  ADP7102ARDZ-R7  [SOIC127P600X175-9N-R241X309]
IC19  ADP7102ARDZ-R7  [SOIC127P600X175-9N-R241X309]
R14  24k  Tolerance: ±1%  [RESC1005X40N]
R15  3k3  Tolerance: ±1%  [RESC1005X40N]
R16  62k  Tolerance: ±1%  [RESC1005X40N]
R78  20k  Tolerance: ±1%  [RESC1005X40N]
R79  62k  Tolerance: ±1%  [RESC1005X40N]
R80  20k  Tolerance: ±1%  [RESC1005X40N]
R81  16k  Tolerance: ±1%  [RESC1005X40N]
R82  15k  Tolerance: ±1%  [RESC1005X40N]

### Nets
+VOP: C91.1 D6.1(A)
-VOP: C93.1 D9.3(C)
GND: C23.1 C24.1 C51.2 C52.1 C54.1 C55.1 C56.1 C57.1 C58.1 C59.1 C91.2 C93.2 IC6.1(GND) IC7.2(GND) IC17.3(GND) IC17.6(GND) IC17.9(EP) IC18.3(GND) IC18.6(GND) IC18.9(EP) IC19.3(GND) IC19.6(GND) IC19.9(EP) R15.1 R78.1 R80.1 R82.1
N10V0A: C24.2 IC6.5(VOUT) R14.2
N12V0_PD: C23.2 IC6.2(VIN) IC6.3(EN)
N14V5LASER: D9.1(A)
P2V5A: C59.2 IC19.1(VOUT) R81.2
P3V3_AFE: C52.2 IC7.5(VOUT)
P5V0_AFE: c.1
P5V0_PD: C55.2 IC17.1(VOUT) R16.2
P5V0A: C57.2 IC18.1(VOUT) R79.2
P12V0_PD: C54.2 C56.2 C58.2 IC17.5(EN/UVLO) IC17.8(VIN) IC18.5(EN/UVLO) IC18.8(VIN) IC19.5(EN/UVLO) IC19.8(VIN)
P14V5LASER: D6.3(C)
Netc_2: c.2 C51.1 IC7.1(VIN) IC7.3(EN)
NetIC6_4: IC6.4(ADJ) R14.1 R15.2
NetIC17_2: IC17.2(ADJ) R16.1 R78.2
NetIC18_2: IC18.2(ADJ) R79.1 R80.2
NetIC19_2: IC19.2(ADJ) R81.1 R82.2

Not connected (* = marked no-connect by the designer): IC7 4(NC)*; IC17 4(NC) 7(PG); IC18 4(NC) 7(PG); IC19 4(NC) 7(PG)

### Notes on the sheet
- (near R15) -1.22V
- (near R78) 1.22V
- (near R80) 1.22V
- (near R82) 1.22V
- Project/Equipment
- Document
- Designer
- Drawn by
- Check.by
- Copyright Creotech Instruments SA 2014.
  This documentation describes Open Hardware and is licensed under the CERN OHL v.1.1. You may redistribute and modify this documentation under the terms of the CERN OHL v.1.1. (http://ohwr.org/CERNOHL). This documentation is distributed WITHOUT ANY EXPRESS OR IMPLIED WARRANTY, INCLUDING OF MERCHANTABILITY, SATISFACTORY QUALITY AND FITNESS FOR A PARTICULAR PURPOSE. Please see the CERN OHL v.1.1 for applicable conditions.
- File
- Last Mod.
- Print Date
- Sheet
- Size
- A3
- of
- Rev
- (in symbol R0402_33R_1%_0.0625W_100PPM) 1%

### Library data of the parts
c = R0402_33R_1%_0.0625W_100PPM: Resistor - 1%; Part Description: General Purpose Thick Film Chip Resistor; Manufacturer: GENERIC; Manufacturer1 Part Number: 232270673309L; TC: ±100ppm/°C; PressFit: No; Part Number: R0402_33R_1%_0.0625W_100PPM; Component Kind: Standard; Component Type: Standard; Pin Count: 2; Value: 33; Status: Not Recommended; Power: 0.0625W; Tolerance: ±1%; Manufacturer Part Number: R0402_33R_1%_0.0625W_100PPM; Case: 0402; Mounted: Yes; Sense: No; Socket: No; SMD: Yes; Manufacturer1 Example: YAGEO PHYCOMP; Manufacturer1 ComponentHeight: 0.4mm; HelpURL: \\cern.ch\dfs\Applications\Altium\Datasheets\R0402_Phycomp_RC0402.pdf; Author: CERN DEM JLC; CreateDate: 03/12/2007; LatestRevisionDate: 17/10/2012
C23 C24 = CC0805_2.2UF_16V_10%_X7R: Non-polarised capacitor; Part Description: SMD Multilayer Chip Ceramic Capacitor; Manufacturer: GENERIC; Manufacturer1 Part Number: GRM21BF51C225ZA01L; Voltage: 16V; TC: X7R; Tolerance: ±10%; Part Number: CC0805_2.2UF_16V_10%_X7R; Component Kind: Standard; Component Type: Standard; Pin Count: 2; Value: 2.2uF; Status: Preferred; Manufacturer Part Number: CC0805_2.2UF_16V_10%_X7R; Case: 0805; Mounted: Yes; Socket: No; SMD: Yes; Sense: No; Manufacturer1 Example: MURATA; Manufacturer1 ComponentHeight: 1.5mm; HelpURL: \\cern.ch\dfs\Applications\Altium\Datasheets\CC0805_X7R_MURATA_GRM.pdf; Author: CERN DEM JLC; CreateDate: 03.12.2007; LatestRevisionDate: 18.09.2014
C51 = CC0805_10UF_16V_10%_X5R: Non-polarised capacitor; Part Description: SMD Multilayer Chip Ceramic Capacitor; Manufacturer: GENERIC; Manufacturer1 Part Number: C0805C106K4PAC; Voltage: 16V; TC: X5R; Tolerance: ±10%; Part Number: CC0805_10UF_16V_10%_X5R; Component Kind: Standard; Component Type: Standard; Pin Count: 2; Value: 10uF; Status: Preferred; Manufacturer Part Number: CC0805_10UF_16V_10%_X5R; Case: 0805; Mounted: Yes; Socket: No; SMD: Yes; Manufacturer1 Example: KEMET; Manufacturer1 ComponentHeight: 1.4mm; HelpURL: \\cern.ch\dfs\Applications\Altium\Datasheets\CC1206_X5R_KEMET.pdf; Author: CERN DEM JLC; CreateDate: 03.12.2007; LatestRevisionDate: 03.12.2007; Sense: No
C52 C54-C59 = CC0603_1UF_25V_10%_X7R: as C16 on sheet LVDS_ADC; Part Number: CC0603_1UF_25V_10%_X7R; Component Kind: Standard; Component Type: Standard; Pin Count: 2; Value: 1uF; Status: None; Manufacturer Part Number: CC0603_1UF_25V_10%_X7R; Case: 0603; Mounted: Yes; Socket: No; SMD: Yes; Sense: No; Manufacturer1 Example: MURATA; Manufacturer1 ComponentHeight: 0.9mm; HelpURL: \\cern.ch\dfs\Applications\Altium\Datasheets\CC0603_X7R_MURATA.pdf; Author: CERN DEM JLC; CreateDate: 18/01/2011; LatestRevisionDate: 18/01/2011
C91 C93 = CC0603_100NF_50V_10%_X7R: as C69 on sheet Laser_module; Part Number: CC0603_100NF_50V_10%_X7R; Component Kind: Standard; Component Type: Standard; Pin Count: 2; Value: 100nF; Status: Preferred; Manufacturer Part Number: CC0603_100NF_50V_10%_X7R; Case: 0603; Mounted: Yes; Socket: No; SMD: Yes; Sense: No; Manufacturer1 Example: PHYCOMP; Manufacturer1 ComponentHeight: 0.87mm; HelpURL: \\cern.ch\dfs\Applications\Altium\Datasheets\CC0603_X7R_PHYCOMP.pdf; Author: CERN DEM JLC; CreateDate: 03.12.2007; LatestRevisionDate: 03.12.2007
D6 D9 = BZX84B10V: Diode Zener Anode Pin 1 Cathode Pin 3 (Pas de pin 2); Part Description: Small Signal Zener Diode; Manufacturer: VISHAY SEMICONDUCTORS; Voltage: 10V; Power: 300mW; PressFit: No; Bonding: No; Part Number: BZX84B10V; Component Kind: Standard; Component Type: Standard; Device: BZX84B10V; PackageDescription: SOT, 0.95mm Pitch; 3 Pin, 1.315mm W X 2.95mm L X 1.15mm H body, IPC Medium Density; Manufacturer Part Number: BZX84B10V; Pin Count: 2; Case: SOT23-3; Mounted: Yes; Socket: No; SMD: Yes; Sense: No; ComponentHeight: 1.15mm; HelpURL: \\cern.ch\dfs\Applications\Altium\Datasheets\BZX84B10V.pdf; Author: CERN DEM JLC; CreateDate: 23.10.2013; LatestRevisionDate: 23.10.2013
IC6 = ADP7182AUJZ-R7: -1.22V to -27V, -200mA, Adjustable, Low Noise, Negative Linear Regulator; Manufacturer: ANALOG DEVICES; PressFit: No; Bonding: No; Part Number: ADP7182AUJZ-R7; Component Kind: Standard; Component Type: Standard; Device: ADP7182AUJZ-R7; PackageDescription: SOT23, 0.95mm Pitch; 5 Pin, 1.75mm W X 3.00mm L X 0.90mm H body, IPC Medium Density; Part Description: -1.22V to -27V, -200mA, Adjustable, Low Noise, Negative Linear Regulator; Manufacturer Part Number: ADP7182AUJZ-R7; Pin Count: 5; Case: SOT23-5; Mounted: Yes; Socket: No; SMD: Yes; Sense: No; ComponentHeight: 0.9mm; HelpURL: \\cern.ch\dfs\Applications\Altium\Datasheets\ADP7182AUJZ-R7.pdf; Author: CERN DEM JLC; CreateDate: 16.06.2014; LatestRevisionDate: 16.06.2014
IC7 = ADP150AUJZ-3.3-R7: Ultralow Noise, 150 mA CMOS Linear Regulator; Part Description: 3.3V, 150mA, Ultralow Noise, CMOS Linear Regulator; Manufacturer: ANALOG DEVICES; PressFit: No; Bonding: No; Part Number: ADP150AUJZ-3.3-R7; Component Kind: Standard; Component Type: Standard; Device: ADP150AUJZ-3.3-R7; PackageDescription: SOT23, 0.95mm pitch; 5 pin, 1.75mm W X 3.00mm L, IPC Medium Density; Manufacturer Part Number: ADP150AUJZ-3.3-R7; Pin Count: 5; Case: SOT23; Mounted: Yes; Socket: No; SMD: Yes; Sense: No; ComponentHeight: 0.9mm; HelpURL: \\cern.ch\dfs\Applications\Altium\Datasheets\ADP150AUJZ-3.3-R7.pdf; Author: CERN DEM JLC; CreateDate: 27/09/2011; LatestRevisionDate: 19/06/2014
IC17-IC19 = ADP7102ARDZ-R7: 1.22V to 19V, 300mA, Low Noise, CMOS LDO Adjustable Linear Regulator; Manufacturer: ANALOG DEVICES; PressFit: No; Bonding: No; Part Number: ADP7102ARDZ-R7; Component Kind: Standard; Component Type: Standard; Device: ADP7102ARDZ-R7; PackageDescription: SOIC 8, Pitch 1.27mm - Body 3.9x4.9mm, (w/Thermal Tab 2.41mm X 3.098mm), IPC Medium Density; Part Description: 1.22V to 19V, 300mA, Low Noise, CMOS LDO Adjustable Linear Regulator; Manufacturer Part Number: ADP7102ARD; Pin Count: 8; Case: SOIC8; Mounted: Yes; Socket: No; SMD: Yes; Sense: No; ComponentHeight: 1.75mm; HelpURL: \\cern.ch\dfs\Applications\Altium\Datasheets\ADP7102ARDZ-R7.pdf; Author: CERN DEM JLC; CreateDate: 16.06.2014; LatestRevisionDate: 01.04.2022
R14 = R0402_24K_1%_0.0625W_100PPM: Resistor - 1%; Part Description: General Purpose Thick Film Chip Resistor; Manufacturer: GENERIC; Manufacturer1 Part Number: 232270672403L; TC: ±100ppm/°C; PressFit: No; Part Number: R0402_24K_1%_0.0625W_100PPM; Component Kind: Standard; Component Type: Standard; Pin Count: 2; Value: 24k; Status: Not Recommended; Power: 0.0625W; Manufacturer Part Number: R0402_24K_1%_0.0625W_100PPM; Case: 0402; Mounted: Yes; Sense: No; Socket: No; SMD: Yes; Manufacturer1 Example: YAGEO PHYCOMP; Manufacturer1 ComponentHeight: 0.4mm; HelpURL: \\cern.ch\dfs\Applications\Altium\Datasheets\R0402_Phycomp_RC0402.pdf; Author: CERN DEM JLC; CreateDate: 03.12.2007; LatestRevisionDate: 17.10.2012
R15 = R0402_3K3_1%_0.0625W_100PPM: Resistor - 1%; Part Description: General Purpose Thick Film Chip Resistor; Manufacturer: GENERIC; Manufacturer1 Part Number: 232270673302L; TC: ±100ppm/°C; PressFit: No; Part Number: R0402_3K3_1%_0.0625W_100PPM; Component Kind: Standard; Component Type: Standard; Pin Count: 2; Value: 3k3; Status: Not Recommended; Power: 0.0625W; Manufacturer Part Number: R0402_3K3_1%_0.0625W_100PPM; Case: 0402; Mounted: Yes; Sense: No; Socket: No; SMD: Yes; Manufacturer1 Example: YAGEO PHYCOMP; Manufacturer1 ComponentHeight: 0.4mm; HelpURL: \\cern.ch\dfs\Applications\Altium\Datasheets\R0402_Phycomp_RC0402.pdf; Author: CERN DEM JLC; CreateDate: 03.12.2007; LatestRevisionDate: 17.10.2012
R16 R79 = R0402_62K_1%_0.0625W_100PPM: Resistor - 1%; Part Description: General Purpose Thick Film Chip Resistor; Manufacturer: GENERIC; Manufacturer1 Part Number: 232270676203L; TC: ±100ppm/°C; PressFit: No; Part Number: R0402_62K_1%_0.0625W_100PPM; Component Kind: Standard; Component Type: Standard; Pin Count: 2; Value: 62k; Status: Not Recommended; Power: 0.0625W; Manufacturer Part Number: R0402_62K_1%_0.0625W_100PPM; Case: 0402; Mounted: Yes; Sense: No; Socket: No; SMD: Yes; Manufacturer1 Example: YAGEO PHYCOMP; Manufacturer1 ComponentHeight: 0.4mm; HelpURL: \\cern.ch\dfs\Applications\Altium\Datasheets\R0402_Phycomp_RC0402.pdf; Author: CERN DEM JLC; CreateDate: 03.12.2007; LatestRevisionDate: 17.10.2012
R78 R80 = R0402_20K_1%_0.0625W_100PPM: Resistor - 1%; Part Description: General Purpose Thick Film Chip Resistor; Manufacturer: GENERIC; Manufacturer1 Part Number: 232270672003L; TC: ±100ppm/°C; PressFit: No; Part Number: R0402_20K_1%_0.0625W_100PPM; Component Kind: Standard; Component Type: Standard; Pin Count: 2; Value: 20k; Status: Not Recommended; Power: 0.0625W; Manufacturer Part Number: R0402_20K_1%_0.0625W_100PPM; Case: 0402; Mounted: Yes; Sense: No; Socket: No; SMD: Yes; Manufacturer1 Example: YAGEO PHYCOMP; Manufacturer1 ComponentHeight: 0.4mm; HelpURL: \\cern.ch\dfs\Applications\Altium\Datasheets\R0402_Phycomp_RC0402.pdf; Author: CERN DEM JLC; CreateDate: 03.12.2007; LatestRevisionDate: 17.10.2012
R81 = R0402_16K_1%_0.0625W_100PPM: Resistor - 1%; Part Description: General Purpose Thick Film Chip Resistor; Manufacturer: GENERIC; Manufacturer1 Part Number: 232270671603L; TC: ±100ppm/°C; PressFit: No; Part Number: R0402_16K_1%_0.0625W_100PPM; Component Kind: Standard; Component Type: Standard; Pin Count: 2; Value: 16k; Status: Not Recommended; Power: 0.0625W; Manufacturer Part Number: R0402_16K_1%_0.0625W_100PPM; Case: 0402; Mounted: Yes; Sense: No; Socket: No; SMD: Yes; Manufacturer1 Example: YAGEO PHYCOMP; Manufacturer1 ComponentHeight: 0.4mm; HelpURL: \\cern.ch\dfs\Applications\Altium\Datasheets\R0402_Phycomp_RC0402.pdf; Author: CERN DEM JLC; CreateDate: 03.12.2007; LatestRevisionDate: 17.10.2012
R82 = R0402_15K_1%_0.0625W_100PPM: Resistor - 1%; Part Description: General Purpose Thick Film Chip Resistor; Manufacturer: GENERIC; Manufacturer1 Part Number: CRCW040215K0FK; TC: ±100ppm/°C; PressFit: No; Part Number: R0402_15K_1%_0.0625W_100PPM; Component Kind: Standard; Component Type: Standard; Pin Count: 2; Value: 15k; Status: None; Power: 0.0625W; Manufacturer Part Number: R0402_15K_1%_0.0625W_100PPM; Case: 0402; Mounted: Yes; Sense: No; Socket: No; SMD: Yes; Manufacturer1 Example: VISHAY; Manufacturer1 ComponentHeight: 0.4mm; HelpURL: \\cern.ch\dfs\Applications\Altium\Datasheets\R0402_VISHAY_CRCW e3.pdf; Author: CERN DEM JMW; CreateDate: 06.07.2015; LatestRevisionDate: 06.07.2015

## Sheet I2C_EXPANDER.SchDoc: AI ARTIQ Driver
size 420 x 297 mm; Author: G.Kasprowicz; CompanyName: CTI; Organization: CTI; Address1: CTI; Address2: Nowowiejska 15/19 00-665 Warsaw; Address3: gkasprow@gmail.com; DocumentNumber: 8; Revision: 0.2; SheetNumber: 8; SheetTotal: 11; ModifiedBy: -; CheckedDate: -; Title2: I2C expander; DivGrp: CTI; ModifiedDate: -; ProjectName: Sensor Box
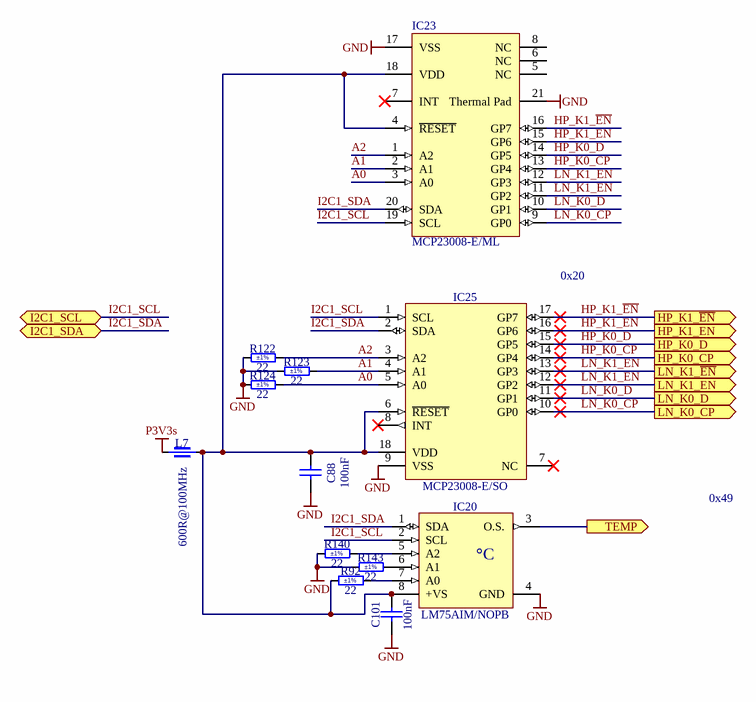
[diagram p5: I2C_EXPANDER.SchDoc]

### Parts
C88  100nF  [CAPC1608X87N]
C101  100nF  [CAPC1608X87N]
IC20  LM75AIM/NOPB  [SOIC127P600X175-8N]
IC23  MCP23008-E/ML  [QFN-ML20_M]
IC25  MCP23008-E/SO  [SOIC127P1030X265-18N]
L7  600R@100MHz  [INDC1608X95N]
R92  22  Tolerance: ±1%  [RESC1608X55N]
R122  22  Tolerance: ±1%  [RESC1608X55N]
R123  22  Tolerance: ±1%  [RESC1608X55N]
R124  22  Tolerance: ±1%  [RESC1608X55N]
R140  22  Tolerance: ±1%  [RESC1608X55N]
R143  22  Tolerance: ±1%  [RESC1608X55N]

### Ports
HP_K0_CP (out), HP_K0_D (out), HP_K1_EN (out), HP_K1_~{EN} (out), I2C1_SCL (bidir), I2C1_SDA (bidir), LN_K0_CP (out), LN_K0_D (out), LN_K1_EN (out), LN_K1_~{EN} (out), TEMP (out)

### Nets
GND: C88.1 C101.1 IC20.4(GND) IC23.17(VSS) IC23.21(Thermal_Pad) IC25.9(VSS) R122.1 R123.1 R124.1 R140.1 R143.1
P3V3s: L7.1
A0: IC23.3(A0) IC25.5(A0) R124.2
A1: IC23.2(A1) IC25.4(A1) R123.2
A2: IC23.1(A2) IC25.3(A2) R122.2
HP_K0_CP: IC23.13(GP4) IC25.14(GP4) ; port HP_K0_CP
HP_K0_D: IC23.14(GP5) IC25.15(GP5) ; port HP_K0_D
HP_K1_~{EN}: IC23.16(GP7) IC25.17(GP7) ; port HP_K1_~{EN}
HP_K1_EN: IC23.15(GP6) IC25.16(GP6) ; port HP_K1_EN
I2C1_SCL: IC20.2(SCL) IC23.19(SCL) IC25.1(SCL) ; port I2C1_SCL
I2C1_SDA: IC20.1(SDA) IC23.20(SDA) IC25.2(SDA) ; port I2C1_SDA
LN_K0_CP: IC23.9(GP0) IC25.10(GP0) ; port LN_K0_CP
LN_K0_D: IC23.10(GP1) IC25.11(GP1) ; port LN_K0_D
LN_K1_~{EN}: IC23.12(GP3) IC25.13(GP3) ; port LN_K1_~{EN}
LN_K1_EN: IC23.11(GP2) IC25.12(GP2) ; port LN_K1_EN
TEMP: IC20.3(O.S.) ; port TEMP
NetC88_2: C88.2 C101.2 IC20.8(+VS) IC23.4(~{RESET}) IC23.18(VDD) IC25.6(~{RESET}) IC25.18(VDD) L7.2 R92.1
NetIC20_5: IC20.5(A2) R140.2
NetIC20_6: IC20.6(A1) R143.2
NetIC20_7: IC20.7(A0) R92.2

Not connected (* = marked no-connect by the designer): IC23 5(NC) 6(NC) 7(INT)* 8(NC); IC25 7(NC)* 8(INT)*

### Notes on the sheet
- 0x20
- 0x49
- Project/Equipment
- Document
- Designer
- Drawn by
- Check.by
- Copyright Creotech Instruments SA 2014.
  This documentation describes Open Hardware and is licensed under the CERN OHL v.1.1. You may redistribute and modify this documentation under the terms of the CERN OHL v.1.1. (http://ohwr.org/CERNOHL). This documentation is distributed WITHOUT ANY EXPRESS OR IMPLIED WARRANTY, INCLUDING OF MERCHANTABILITY, SATISFACTORY QUALITY AND FITNESS FOR A PARTICULAR PURPOSE. Please see the CERN OHL v.1.1 for applicable conditions.
- File
- Last Mod.
- Print Date
- Sheet
- Size
- A3
- of
- Rev
- (in symbol LM75AIM/NOPB) °C

### Library data of the parts
C88 C101 = CC0603_100NF_50V_10%_X7R: Non-polarised capacitor; Part Description: SMD Multilayer Chip Ceramic Capacitor; Manufacturer: GENERIC; Manufacturer1 Part Number: 223858615649; Voltage: 50V; TC: X7R; Tolerance: ±10%; Part Number: CC0603_100NF_50V_10%_X7R; Component Kind: Standard; Component Type: Standard; Pin Count: 2; Value: 100nF; Status: Preferred; Manufacturer Part Number: CC0603_100NF_50V_10%_X7R; Case: 0603; Mounted: Yes; Socket: No; SMD: Yes; Sense: No; Manufacturer1 Example: PHYCOMP; Manufacturer1 ComponentHeight: 0.87mm; HelpURL: \\cern.ch\dfs\Applications\Altium\Datasheets\CC0603_X7R_PHYCOMP.pdf; Author: CERN DEM JLC; CreateDate: 03.12.2007; LatestRevisionDate: 03.12.2007
IC20 = LM75AIM/NOPB: Digital Temperature Sensor and Thermal Watchdog with Two-Wire Interface; Part Description: -25° to +100°C ±2°C Digital Temperature Sensor and Thermal Watchdog with Two-Wire Interface; Manufacturer: TEXAS INSTRUMENTS; PressFit: No; Bonding: No; Part Number: LM75AIM/NOPB; Component Kind: Standard; Component Type: Standard; Device: LM75AIM/NOPB; PackageDescription: SOIC 8, Pitch 1.27mm - Body 4x5mm, IPC Medium Density; Manufacturer Part Number: LM75AIM/NOPB; Pin Count: 8; Case: SOIC8; Mounted: Yes; Socket: No; SMD: Yes; Sense: No; ComponentHeight: 1.75mm; HelpURL: \\cern.ch\dfs\Applications\Altium\Datasheets\LM75AIM-NOPB.pdf; Author: CERN DEM JLC; CreateDate: 15.10.2012; LatestRevisionDate: 15.10.2012
IC23 = CMP-0186-00018-2: 8-Bit I/O Expander with Serial Interface, 20-Pin QFN, Extended Temperature; ComponentLink2URL: http://ww1.microchip.com/downloads/en/DeviceDoc/21919e.pdf; ComponentLink1Description: Manufacturer URL; ComponentLink3Description: Package Specification; ComponentLink1URL: http://www.microchip.com/; RevisionNote: URLs added.; PackageReference: QFN-ML20; ComponentLink2Description: Datasheet; PackageDescription: 20-Lead Plastic Quad Flat, No Lead Package (ML) - 4x4x0.9 mm Body [QFN]; ComponentLink3URL: http://www.microchip.com/stellent/groups/techpub_sg/documents/packagingspec/en012702.pdf; DatasheetVersion: revE, Aug-2007; PackageVersion: revBB, Aug-2009
IC25 = MCP23008-E/SO: 8-Bit I/O Expander with Serial Interface; Manufacturer: MICROCHIP TECHNOLOGY; PressFit: No; Bonding: No; Part Number: MCP23008-E/SO; Component Kind: Standard; Component Type: Standard; Device: MCP23008-E/SO; PackageDescription: SOIC, 18-Leads, Body 13.9x7.6mm (max), Pitch 1.27mm, IPC Medium Density; Part Description: 8-Bit I/O Expander with Serial Interface; Manufacturer Part Number: MCP23008-E/SO; Pin Count: 18; Case: SOIC18; Mounted: Yes; Socket: No; SMD: Yes; Sense: No; ComponentHeight: 2.65mm; Author: CERN DEM JLC; HelpURL: \\cern.ch\dfs\Applications\Altium\Datasheets\MCP23008-E-SO.pdf; CreateDate: 30.10.2012; LatestRevisionDate: 30.10.2012
L7 = IND0603_MURATA_BLM18AG601SN1: Part Description: SMD EMIFIL Suppression Chip Ferrite Bead; Manufacturer: MURATA; Power: 500mA; Resistance: 0.38R; Tolerance: ±25%; Part Number: IND0603_MURATA_BLM18AG601SN1; Component Kind: Standard; Component Type: Standard; Pin Count: 2; Value: 600R@100MHz; Status: None; Manufacturer Part Number: BLM18AG601SN1; Case: 0603; Mounted: Yes; Socket: No; SMD: Yes; Sense: No; ComponentHeight: 0.95mm; HelpURL: \\cern.ch\dfs\Applications\Altium\Datasheets\IND0603_MURATA_BLM18A.pdf; Author: CERN DEM MR; CreateDate: 01.04.2016; LatestRevisionDate: 25.10.2018
R92 R122-R124 R140 R143 = R0603_22R_1%_0.1W_100PPM: Resistor - 1%; Part Description: General Purpose Thick Film Chip Resistor; Manufacturer: GENERIC; Manufacturer1 Part Number: NRC06F22R0TRF; Power: 0.1W; TC: ±100ppm/°C; PressFit: No; Part Number: R0603_22R_1%_0.1W_100PPM; Component Kind: Standard; Component Type: Standard; Pin Count: 2; Value: 22; Status: Preferred; Manufacturer Part Number: R0603_22R_1%_0.1W_100PPM; Case: 0603; Mounted: Yes; Sense: No; Socket: No; SMD: Yes; Manufacturer1 Example: NIC COMPONENT; Manufacturer1 ComponentHeight: 0.55mm; HelpURL: \\cern.ch\dfs\Applications\Altium\Datasheets\R0603_NIC_NRC.pdf; Author: CERN DEM JLC; CreateDate: 03.12.2007; LatestRevisionDate: 13.03.2008